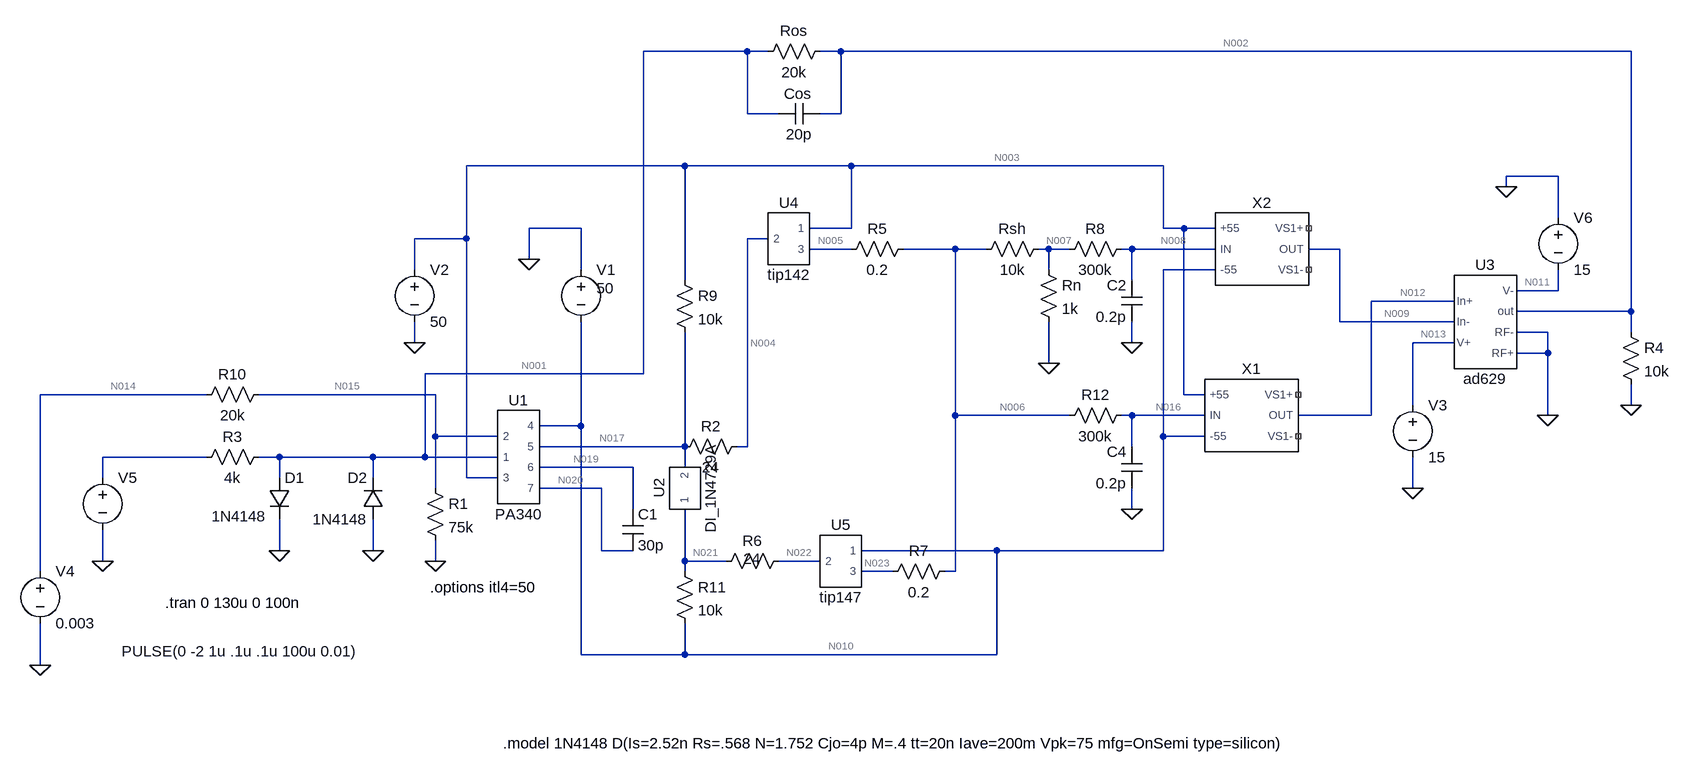
[diagram p0: schematic Draft18.asc]
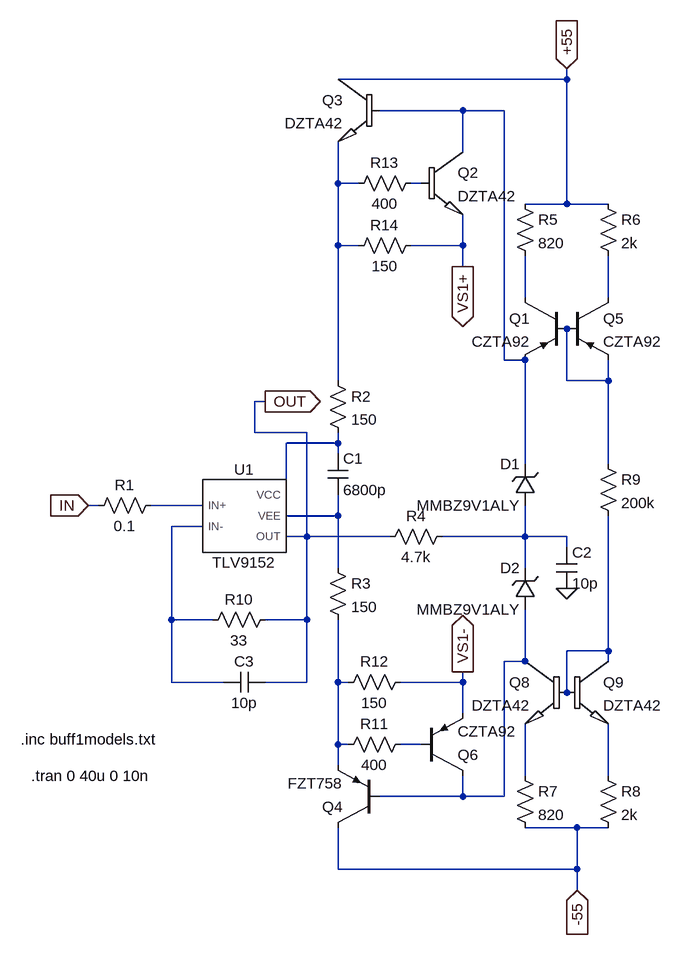
[diagram p1: sub-circuit draft1.asc]
Draft18.asc, the LTspice schematic file:
Version 4
SHEET 1 1972 884
WIRE 544 -464 384 -464
WIRE 576 -464 544 -464
WIRE 688 -464 656 -464
WIRE 1904 -464 688 -464
WIRE 544 -368 544 -464
WIRE 592 -368 544 -368
WIRE 688 -368 688 -464
WIRE 688 -368 656 -368
WIRE 448 -288 112 -288
WIRE 704 -288 448 -288
WIRE 1184 -288 704 -288
WIRE 1792 -272 1712 -272
WIRE 1712 -256 1712 -272
WIRE 1792 -208 1792 -272
WIRE 288 -192 208 -192
WIRE 704 -192 704 -288
WIRE 704 -192 640 -192
WIRE 1184 -192 1184 -288
WIRE 1216 -192 1184 -192
WIRE 1264 -192 1216 -192
WIRE 112 -176 112 -288
WIRE 112 -176 32 -176
WIRE 576 -176 544 -176
WIRE 704 -160 640 -160
WIRE 864 -160 784 -160
WIRE 912 -160 864 -160
WIRE 1008 -160 992 -160
WIRE 1040 -160 1008 -160
WIRE 1136 -160 1120 -160
WIRE 1264 -160 1136 -160
WIRE 1456 -160 1408 -160
WIRE 208 -144 208 -192
WIRE 32 -128 32 -176
WIRE 288 -128 288 -192
WIRE 1008 -128 1008 -160
WIRE 1264 -128 1184 -128
WIRE 448 -112 448 -288
WIRE 1136 -112 1136 -160
WIRE 1792 -96 1792 -128
WIRE 1792 -96 1728 -96
WIRE 1632 -80 1504 -80
WIRE 1904 -64 1904 -464
WIRE 1904 -64 1728 -64
WIRE 1456 -48 1456 -160
WIRE 1632 -48 1456 -48
WIRE 1776 -32 1728 -32
WIRE 1904 -32 1904 -64
WIRE 32 -16 32 -48
WIRE 1136 -16 1136 -48
WIRE 1632 -16 1568 -16
WIRE 1776 0 1776 -32
WIRE 1776 0 1728 0
WIRE 1008 16 1008 -48
WIRE 384 32 384 -464
WIRE 384 32 48 32
WIRE -288 64 -544 64
WIRE 64 64 -208 64
WIRE 1216 64 1216 -192
WIRE 1248 64 1216 64
WIRE 1568 80 1568 -16
WIRE 1904 80 1904 48
WIRE 864 96 864 -160
WIRE 1040 96 864 96
WIRE 1136 96 1120 96
WIRE 1248 96 1136 96
WIRE 1504 96 1504 -80
WIRE 1504 96 1392 96
WIRE 1776 96 1776 0
WIRE 288 112 288 -48
WIRE 288 112 224 112
WIRE 64 128 64 64
WIRE 160 128 64 128
WIRE 1184 128 1184 -128
WIRE 1248 128 1184 128
WIRE 448 144 448 -32
WIRE 448 144 224 144
WIRE 544 144 544 -176
WIRE 544 144 528 144
WIRE 1136 144 1136 96
WIRE -288 160 -448 160
WIRE -176 160 -208 160
WIRE -32 160 -176 160
WIRE 48 160 48 32
WIRE 48 160 -32 160
WIRE 160 160 48 160
WIRE 368 176 224 176
WIRE 448 176 448 144
WIRE -448 192 -448 160
WIRE -176 192 -176 160
WIRE -32 192 -32 160
WIRE 112 192 112 -176
WIRE 160 192 112 192
WIRE 64 208 64 128
WIRE 320 208 224 208
WIRE 1568 208 1568 160
WIRE 368 240 368 176
WIRE 1136 240 1136 208
WIRE -176 304 -176 256
WIRE -32 304 -32 256
WIRE 320 304 320 208
WIRE 368 304 320 304
WIRE 928 304 720 304
WIRE 1184 304 1184 128
WIRE 1184 304 928 304
WIRE -448 320 -448 272
WIRE 64 320 64 288
WIRE 448 320 448 240
WIRE 512 320 448 320
WIRE 656 320 592 320
WIRE -544 336 -544 64
WIRE 448 336 448 320
WIRE 768 336 720 336
WIRE 864 336 864 96
WIRE 864 336 848 336
WIRE 288 464 288 112
WIRE 448 464 448 416
WIRE 448 464 288 464
WIRE 928 464 928 304
WIRE 928 464 448 464
WIRE -544 480 -544 416
FLAG 32 -16 0
FLAG 208 -144 0
FLAG -544 480 0
FLAG 1008 16 0
FLAG -448 320 0
FLAG 64 320 0
FLAG 1568 208 0
FLAG 1776 96 0
FLAG 1712 -256 0
FLAG 1904 80 0
FLAG 1136 -16 0
FLAG 1136 240 0
FLAG -176 304 0
FLAG -32 304 0
SYMBOL PA340 192 160 R0
SYMATTR InstName U1
SYMBOL res 48 192 R0
SYMATTR InstName R1
SYMATTR Value 75k
SYMBOL res 544 128 R90
WINDOW 0 0 56 VBottom 2
WINDOW 3 32 56 VTop 2
SYMATTR InstName R2
SYMATTR Value 24
SYMBOL res -192 144 R90
WINDOW 0 0 56 VBottom 2
WINDOW 3 32 56 VTop 2
SYMATTR InstName R3
SYMATTR Value 4k
SYMBOL cap 352 240 R0
SYMATTR InstName C1
SYMATTR Value 30p
SYMBOL voltage 288 -144 R0
WINDOW 3 24 44 Left 2
WINDOW 123 0 0 Left 0
WINDOW 39 0 0 Left 0
SYMATTR Value 50
SYMATTR InstName V1
SYMBOL voltage 32 -144 R0
WINDOW 123 0 0 Left 0
WINDOW 39 0 0 Left 0
SYMATTR InstName V2
SYMATTR Value 50
SYMBOL res 992 -144 R0
SYMATTR InstName Rn
SYMATTR Value 1k
SYMBOL res 672 -480 R90
WINDOW 0 0 56 VBottom 2
WINDOW 3 32 56 VTop 2
SYMATTR InstName Ros
SYMATTR Value 20k
SYMBOL cap 656 -384 R90
WINDOW 0 1 34 VBottom 2
WINDOW 3 32 32 VTop 2
SYMATTR InstName Cos
SYMATTR Value 20p
SYMBOL res -192 48 R90
WINDOW 0 0 56 VBottom 2
WINDOW 3 32 56 VTop 2
SYMATTR InstName R10
SYMATTR Value 20k
SYMBOL voltage -448 176 R0
WINDOW 123 0 0 Left 0
WINDOW 39 0 0 Left 0
WINDOW 3 29 283 Left 2
SYMATTR Value PULSE(0 -2 1u .1u .1u 100u 0.01)
SYMATTR InstName V5
SYMBOL res 608 304 R90
WINDOW 0 0 56 VBottom 2
WINDOW 3 28 56 VBottom 2
SYMATTR InstName R6
SYMATTR Value 24
SYMBOL voltage -544 320 R0
WINDOW 123 0 0 Left 0
WINDOW 39 0 0 Left 0
SYMATTR InstName V4
SYMATTR Value 0.003
SYMBOL tip142 608 -176 R0
SYMATTR InstName U4
SYMBOL tip147 688 320 R0
SYMATTR InstName U5
SYMBOL res 800 -176 R90
WINDOW 0 0 56 VBottom 2
WINDOW 3 32 56 VTop 2
SYMATTR InstName R5
SYMATTR Value 0.2
SYMBOL res 864 320 R90
WINDOW 0 0 56 VBottom 2
WINDOW 3 32 56 VTop 2
SYMATTR InstName R7
SYMATTR Value 0.2
SYMBOL res 432 -128 R0
SYMATTR InstName R9
SYMATTR Value 10k
SYMBOL res 432 320 R0
SYMATTR InstName R11
SYMATTR Value 10k
SYMBOL DI_1N4729A 448 208 R270
SYMATTR InstName U2
SYMBOL Draft1 1328 -160 R0
SYMATTR InstName X2
SYMBOL res 1008 -176 R90
WINDOW 0 0 56 VBottom 2
WINDOW 3 32 56 VTop 2
SYMATTR InstName Rsh
SYMATTR Value 10k
SYMBOL ad629 1680 -48 R0
SYMATTR InstName U3
SYMBOL voltage 1568 64 R0
WINDOW 123 0 0 Left 0
WINDOW 39 0 0 Left 0
SYMATTR InstName V3
SYMATTR Value 15
SYMBOL voltage 1792 -224 R0
WINDOW 123 0 0 Left 0
WINDOW 39 0 0 Left 0
SYMATTR InstName V6
SYMATTR Value 15
SYMBOL Draft1 1312 96 R0
SYMATTR InstName X1
SYMBOL res 1888 -48 R0
SYMATTR InstName R4
SYMATTR Value 10k
SYMBOL res 1136 -176 R90
WINDOW 0 0 56 VBottom 2
WINDOW 3 32 56 VTop 2
SYMATTR InstName R8
SYMATTR Value 300k
SYMBOL res 1136 80 R90
WINDOW 0 0 56 VBottom 2
WINDOW 3 32 56 VTop 2
SYMATTR InstName R12
SYMATTR Value 300k
SYMBOL cap 1152 -48 R180
WINDOW 0 24 56 Left 2
WINDOW 3 24 8 Left 2
SYMATTR InstName C2
SYMATTR Value 0.2p
SYMBOL cap 1152 208 R180
WINDOW 0 24 56 Left 2
WINDOW 3 24 8 Left 2
SYMATTR InstName C4
SYMATTR Value 0.2p
SYMBOL diode -192 192 R0
WINDOW 3 -88 59 Left 2
SYMATTR InstName D1
SYMATTR Value 1N4148
SYMBOL diode -16 256 R180
WINDOW 0 24 64 Left 2
WINDOW 3 24 0 Left 2
SYMATTR InstName D2
SYMATTR Value 1N4148
TEXT -352 384 Left 2 !.tran 0 130u 0 100n
TEXT 56 360 Left 2 !.options itl4=50
TEXT 168 600 Left 2 !.model 1N4148 D(Is=2.52n Rs=.568 N=1.752 Cjo=4p M=.4 tt=20n Iave=200m Vpk=75 mfg=OnSemi type=silicon)

draft1.asc, the sub-circuit schematic file:
Version 4
SHEET 1 1440 892
WIRE 688 -496 688 -512
WIRE 688 -496 336 -496
WIRE 528 -448 400 -448
WIRE 592 -448 528 -448
WIRE 528 -384 528 -448
WIRE 336 -336 336 -400
WIRE 368 -336 336 -336
WIRE 464 -336 448 -336
WIRE 688 -304 688 -496
WIRE 688 -304 624 -304
WIRE 752 -304 688 -304
WIRE 336 -240 336 -336
WIRE 368 -240 336 -240
WIRE 528 -240 528 -288
WIRE 528 -240 448 -240
WIRE 528 -208 528 -240
WIRE 624 -160 624 -224
WIRE 752 -160 752 -224
WIRE 592 -64 592 -448
WIRE 624 -64 592 -64
WIRE 336 -32 336 -240
WIRE 688 -32 688 -112
WIRE 752 -32 752 -64
WIRE 752 -32 688 -32
WIRE 224 0 208 0
WIRE 208 48 208 0
WIRE 288 48 208 48
WIRE 336 64 336 48
WIRE 336 64 256 64
WIRE 336 80 336 64
WIRE 624 96 624 -64
WIRE 752 96 752 -32
WIRE 256 144 256 64
WIRE -32 160 -48 160
WIRE 128 160 48 160
WIRE 336 176 336 144
WIRE 336 176 256 176
WIRE 128 192 80 192
WIRE 288 208 288 48
WIRE 288 208 256 208
WIRE 416 208 288 208
WIRE 624 208 624 160
WIRE 624 208 496 208
WIRE 688 208 624 208
WIRE 688 224 688 208
WIRE 336 256 336 176
WIRE 624 256 624 208
WIRE 80 336 80 192
WIRE 144 336 80 336
WIRE 288 336 288 208
WIRE 288 336 224 336
WIRE 752 384 752 176
WIRE 752 384 688 384
WIRE 624 400 624 320
WIRE 624 400 592 400
WIRE 752 400 752 384
WIRE 80 432 80 336
WIRE 160 432 80 432
WIRE 288 432 288 336
WIRE 288 432 224 432
WIRE 336 432 336 336
WIRE 352 432 336 432
WIRE 528 432 528 416
WIRE 528 432 432 432
WIRE 688 448 688 384
WIRE 528 480 528 432
WIRE 336 528 336 432
WIRE 352 528 336 528
WIRE 464 528 432 528
WIRE 336 560 336 528
WIRE 624 576 624 496
WIRE 752 576 752 496
WIRE 528 608 528 576
WIRE 528 608 400 608
WIRE 592 608 592 400
WIRE 592 608 528 608
WIRE 704 656 624 656
WIRE 752 656 704 656
WIRE 336 720 336 656
WIRE 704 720 704 656
WIRE 704 720 336 720
WIRE 704 752 704 720
FLAG 688 288 0
FLAG -48 160 IN
IOPIN -48 160 In
FLAG 224 0 OUT
IOPIN 224 0 Out
FLAG 688 -512 +55
IOPIN 688 -512 In
FLAG 704 752 -55
IOPIN 704 752 In
FLAG 528 416 VS1-
IOPIN 528 416 Out
FLAG 528 -208 VS1+
IOPIN 528 -208 Out
SYMBOL TLV9152 192 176 R0
SYMATTR InstName U1
SYMBOL res 320 -48 R0
SYMATTR InstName R2
SYMATTR Value 150
SYMBOL res 320 240 R0
SYMATTR InstName R3
SYMATTR Value 150
SYMBOL res 512 192 R90
WINDOW 0 0 56 VBottom 2
WINDOW 3 32 56 VTop 2
SYMATTR InstName R4
SYMATTR Value 4.7k
SYMBOL res 608 -320 R0
SYMATTR InstName R5
SYMATTR Value 820
SYMBOL res 736 -320 R0
SYMATTR InstName R6
SYMATTR Value 2k
SYMBOL res 608 560 R0
SYMATTR InstName R7
SYMATTR Value 820
SYMBOL res 736 560 R0
SYMATTR InstName R8
SYMATTR Value 2k
SYMBOL res 736 80 R0
SYMATTR InstName R9
SYMATTR Value 200k
SYMBOL res 240 320 R90
WINDOW 0 0 56 VBottom 2
WINDOW 3 32 56 VTop 2
SYMATTR InstName R10
SYMATTR Value 33
SYMBOL cap 320 80 R0
SYMATTR InstName C1
SYMATTR Value 6800p
SYMBOL zener 640 160 R180
WINDOW 0 24 64 Left 2
WINDOW 3 24 0 Left 2
SYMATTR InstName D1
SYMATTR Value MMBZ9V1ALY
SYMBOL zener 640 320 R180
WINDOW 0 24 64 Left 2
WINDOW 3 24 0 Left 2
SYMATTR InstName D2
SYMATTR Value MMBZ9V1ALY
SYMBOL cap 672 224 R0
SYMATTR InstName C2
SYMATTR Value 10p
SYMBOL pnp 688 -160 M0
SYMATTR InstName Q1
SYMATTR Value CZTA92
SYMBOL pnp 688 -160 R0
SYMATTR InstName Q5
SYMATTR Value CZTA92
SYMBOL pnp 400 656 R180
SYMATTR InstName Q4
SYMATTR Value FZT758
SYMBOL res 64 144 R90
WINDOW 0 0 56 VBottom 2
WINDOW 3 32 56 VTop 2
SYMATTR InstName R1
SYMATTR Value 0.1
SYMBOL pnp 464 576 M180
SYMATTR InstName Q6
SYMATTR Value CZTA92
SYMBOL res 448 512 R90
WINDOW 0 0 56 VBottom 2
WINDOW 3 32 56 VTop 2
SYMATTR InstName R11
SYMATTR Value 400
SYMBOL res 448 416 R90
WINDOW 0 0 56 VBottom 2
WINDOW 3 32 56 VTop 2
SYMATTR InstName R12
SYMATTR Value 150
SYMBOL res 464 -352 R90
WINDOW 0 0 56 VBottom 2
WINDOW 3 32 56 VTop 2
SYMATTR InstName R13
SYMATTR Value 400
SYMBOL res 464 -256 R90
WINDOW 0 0 56 VBottom 2
WINDOW 3 32 56 VTop 2
SYMATTR InstName R14
SYMATTR Value 150
SYMBOL DZTA42 464 -384 R0
SYMATTR InstName Q2
SYMBOL DZTA42 400 -496 M0
SYMATTR InstName Q3
SYMBOL DZTA42 688 400 M0
SYMATTR InstName Q8
SYMBOL DZTA42 688 400 R0
SYMATTR InstName Q9
SYMBOL cap 224 416 R90
WINDOW 0 0 32 VBottom 2
WINDOW 3 32 32 VTop 2
SYMATTR InstName C3
SYMATTR Value 10p
TEXT -152 520 Left 2 !.inc buff1models.txt
TEXT -136 576 Left 2 !.tran 0 40u 0 10n

The netlist it stands for:
* Draft18.asc
XU1 N015 N001 N003 N010 N017 N019 N020 PA340  ; pins 2 1 3 4 5 6 7
R1 N015 0 75k
R2 N004 N017 24
R3 N001 N018 4k
C1 N019 N020 30p
V1 0 N010 50
V2 N003 0 50
Rn N007 0 1k
Ros N002 N001 20k
Cos N002 N001 20p
R10 N015 N014 20k
V5 N018 0 PULSE(0 -2 1u .1u .1u 100u 0.01)
R6 N022 N021 24
V4 N014 0 0.003
XU4 N003 N004 N005 tip142  ; pins 1 2 3
XU5 N010 N022 N023 tip147  ; pins 1 2 3
R5 N006 N005 0.2
R7 N006 N023 0.2
R9 N003 N017 10k
R11 N021 N010 10k
XU2 N021 N017 DI_1N4729A  ; pins 1 2
XX2 N003 N010 N008 N009 NC_01 NC_02 draft1
Rsh N007 N006 10k
XU3 N012 N009 N013 N011 N002 0 0 ad629  ; pins In+ In- V+ V- out RF- RF+
V3 N013 0 15
V6 0 N011 15
XX1 N003 N010 N016 N012 NC_03 NC_04 draft1
R4 N002 0 10k
R8 N008 N007 300k
R12 N016 N006 300k
C2 0 N008 0.2p
C4 0 N016 0.2p
D1 N001 0 1N4148
D2 0 N001 1N4148

* block symbol definitions
.subckt draft1 +55 -55 IN OUT VS1+ VS1-
XU1 N008 N010 N007 N009 OUT TLV9152  ; pins IN+ IN- VCC VEE OUT
R2 N002 N007 150
R3 N009 N014 150
R4 N011 OUT 4.7k
R5 +55 N004 820
R6 +55 N005 2k
R7 N016 -55 820
R8 N017 -55 2k
R9 N006 N012 200k
R10 OUT N010 33
C1 N007 N009 6800p
D1 N011 N001 MMBZ9V1ALY
D2 N013 N011 MMBZ9V1ALY
C2 N011 0 10p
Q1 N004 N006 N001 0 CZTA92
Q5 N005 N006 N006 0 CZTA92
Q4 -55 N013 N014 0 FZT758
R1 N008 IN 0.1
Q6 N013 N015 VS1- 0 CZTA92
R11 N015 N014 400
R12 VS1- N014 150
R13 N003 N002 400
R14 VS1+ N002 150
Q2 N001 N003 VS1+ 0 DZTA42
Q3 +55 N001 N002 0 DZTA42
Q8 N013 N012 N016 0 DZTA42
Q9 N012 N012 N017 0 DZTA42
C3 OUT N010 10p
.inc buff1models.txt
.tran 0 40u 0 10n
.ends draft1

.model D D
.lib standard.dio
.model NPN NPN
.model PNP PNP
.lib standard.bjt
.tran 0 130u 0 100n
.options itl4=50
.model 1N4148 D(Is=2.52n Rs=.568 N=1.752 Cjo=4p M=.4 tt=20n Iave=200m Vpk=75 mfg=OnSemi type=silicon)
.lib PA340_Pspice.LIB
.lib TIP142.cir
.lib TIP147.cir
.lib 1N4729A.cir
.lib .\tlv9152.lib
.lib DZTA42
.lib ad629.cir
.backanno
.end

* Results of the author's LTspice run, read from the files saved beside the schematic
* Operating Point, zero values left out:
*   V(n001) = 14.39 mV
*   V(n010) = -50 V
*   V(n017) = 1.828 V
*   V(n020) = 1.849 V
*   V(n007) = 8.59 mV
*   V(n014) = 3 mV
*   V(n022) = -1.491 V
*   V(n005) = 98.16 mV
*   V(n008) = 8.588 mV
*   V(n013) = 15 V
*   V(n016) = 94.49 mV
*   V(n015) = 2.368 mV
*   V(n003) = 50 V
*   V(n019) = -1.479 mV
*   V(n004) = 1.818 V
*   V(n002) = 86.4 mV
*   V(n021) = -1.496 V
*   V(n023) = 90.83 mV
*   V(n006) = 94.5 mV
*   V(n009) = 8.713 mV
*   V(n012) = 94.62 mV
*   V(n011) = -15 V
*   I(R2) = -419.9 µA
*   I(R3) = 3.598 µA
*   I(V1) = -29.37 mA
*   I(Rn) = 8.59 µA
*   I(R10) = -31.62 nA
*   I(R5) = -18.32 mA
*   I(R9) = 4.817 mA
*   I(R8) = -9.659 pA
*   I(R12) = -9.667 pA
*   I(Ros) = 3.6 µA
*   I(V4) = -31.62 nA
*   I(Rsh) = -8.59 µA
*   I(V6) = -896.1 µA
*   I(V5) = 3.598 µA
*   I(R6) = 212.6 µA
*   I(R7) = 18.31 mA
*   I(R11) = 4.85 mA
*   I(R4) = 8.64 µA
*   I(R1) = 31.57 nA
*   I(V2) = -29.38 mA
*   I(V3) = -908.6 µA
*   I(D1) = 942.2 pA
*   I(D2) = -685.8 pA
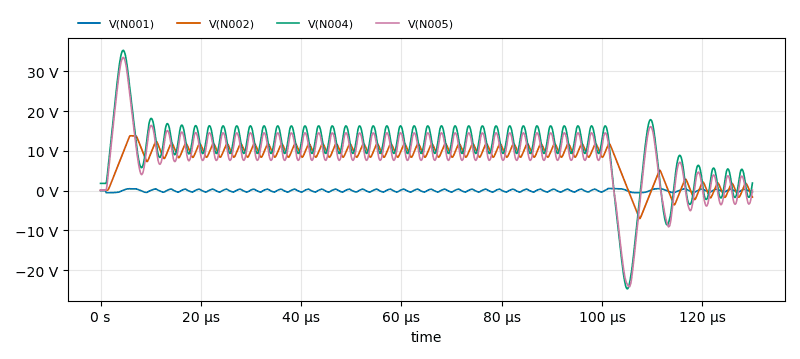
[diagram p2: Transient Analysis of Draft18.asc, plotted from the saved traces]
* Transient Analysis, 1 run:
*   V(N001): min -534.7 mV, max 549 mV, average 13.5 mV, rms 276.5 mV, last -349.1 mV
*   V(N002): min -7.013 V, max 13.78 V, average 7.808 V, rms 9.033 V, last -1.599 V
*   V(N004): min -24.65 V, max 35.23 V, average 10.26 V, rms 13.03 V, last 1.911 V
*   V(N005): min -24.17 V, max 33.45 V, average 8.653 V, rms 11.61 V, last 115.3 mV